# EAGLE schematic schematics (EAGLE 6.1)
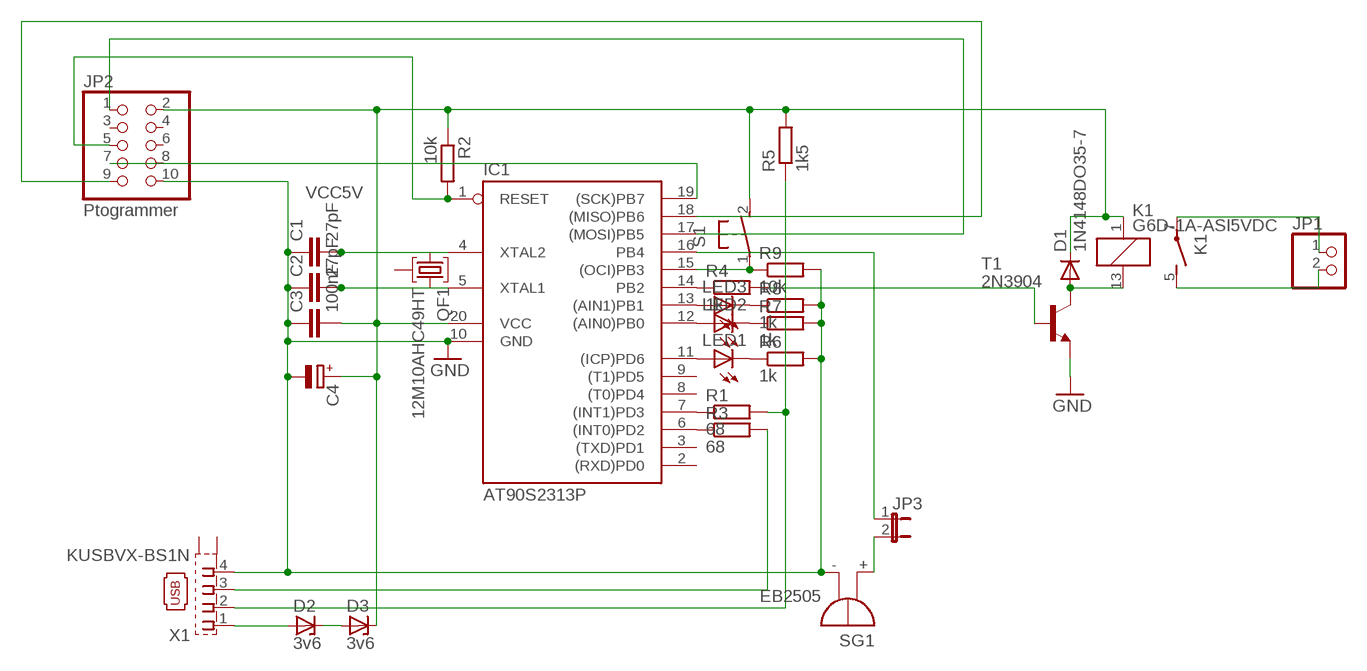
[diagram p0: schematic, sheet 1]

## Parts
C1  27pF  C-EU025-024X044  [C025-024X044]
C2  27pF  C-EU025-024X044  [C025-024X044]
C3  100nF  C-EU025-024X044  [C025-024X044]
C4  CPOL-EUE2.5-7  [E2,5-7]
D1  1N4148DO35-7  [DO35-7]
D2  3v6  ZENER-DIODEDO35Z10  [DO35Z10]
D3  3v6  ZENER-DIODEDO35Z10  [DO35Z10]
IC1  AT90S2313P  [DIL20]
JP1  PINHD-1X2/90  [1X02/90]
JP2  Ptogrammer  PINHD-2X5  [2X05]
JP3  JP1E  [JP1]
K1  G6D-1A-ASI5VDC  [G6D]
LED1  LED3MM  [LED3MM]
LED2  LED3MM  [LED3MM]
LED3  LED3MM  [LED3MM]
QF1  12M10AHC49HT  [HC49U]
R1  68  R-EU_0204/5  [0204/5]
R2  10k  R-EU_0207/10  [0207/10]
R3  68  R-EU_0204/5  [0204/5]
R4  1k  R-EU_0204/5  [0204/5]
R5  1k5  R-EU_0204/5  [0204/5]
R6  1k  R-EU_0204/5  [0204/5]
R7  1k  R-EU_0204/5  [0204/5]
R8  1k  R-EU_0204/5  [0204/5]
R9  10k  R-EU_0207/10  [0207/10]
S1  31-XX  [B3F-31XX]
SG1  EB2505  [EB2505]
T1  2N3904  2N2222-NPN-TO92-EBC  [TO92-EBC]
X1  KUSBVX-BS1N  [KUSBVX-BS1N]

## Nets
GND: C1.1 C2.1 C3.1 C4.- IC1.10(GND) JP2.10 R6.2 R7.2 R8.2 R9.2 SG1.- T1.E X1.4
N$1: IC1.1(RESET) JP2.5 R2.2
N$2: IC1.7((INT1)PD3) R1.1
N$3: C2.2 IC1.5(XTAL1) QF1.3
N$4: IC1.6((INT0)PD2) R3.1
N$5: R1.2 R5.1 X1.2
N$6: IC1.12((AIN0)PB0) LED2.A
N$7: IC1.13((AIN1)PB1) LED3.A
N$8: D1.A K1.13 T1.C
N$9: C1.2 IC1.4(XTAL2) QF1.1
N$10: JP1.1 K1.7(2:P)
N$11: JP1.2 K1.5(2:S)
N$12: D2.C D3.A
N$13: D2.A X1.1
N$14: R3.2 X1.3
N$15: IC1.11((ICP)PD6) LED1.A
N$16: IC1.14(PB2) R4.1
N$17: R4.2 T1.B
N$18: LED2.K(C) R7.1
N$19: LED3.K(C) R8.1
N$20: LED1.K(C) R6.1
N$21: JP3.2 SG1.+
N$22: IC1.15((OCI)PB3) R9.1 S1.1(P)
N$23: IC1.16(PB4) JP3.1
N$24: IC1.17((MOSI)PB5) JP2.1
N$25: IC1.18((MISO)PB6) JP2.9
N$27: IC1.19((SCK)PB7) JP2.7
VCC5V: C3.2 C4.+ D1.C D3.C IC1.20(VCC) JP2.2 K1.1 R2.1 R5.2 S1.2(S)
Unconnected: IC1.2((RXD)PD0) IC1.3((TXD)PD1) IC1.8((T0)PD4) IC1.9((T1)PD5) JP2.3 JP2.4 JP2.6 JP2.8 QF1.2 X1.M1(S1) X1.M2(S2)

## Library data of the parts
C1-C3 = rcl:C-EU: CAPACITOR, European symbol
C4 = rcl:CPOL-EU: POLARIZED CAPACITOR, European symbol
D1 = diode:1N4148: DIODE high speed (Philips)
D2 D3 = diode:ZENER-DIODE: Z-Diode
IC1 = atmel:AT90S2313: MICROCONTROLLER 2 Kbytes FLASH 128 bytes SRAM 128 bytes EEPROM UART; OC_FARNELL: unknown; OC_NEWARK: unknown
JP1 = pinhead:PINHD-1X2: PIN HEADER
JP2 = pinhead:PINHD-2X5: PIN HEADER
JP3 = jumper:JP1E: JUMPER
K1 = relay:G6D?*: OMRON Slim, Miniature PCB Relay 17.5 × 6.5 × 12.5 mm with Socked Source: http://ecb.omron.com.sg/pdf/relay/power/G6D.pdf; OC_FARNELL: 9812660; OC_NEWARK: unknown
LED1-LED3 = led:LED: LED OSRAM: - CHIPLED LG R971, LG N971, LY N971, LG Q971, LY Q971, LO R971, LY R971 LH N974, LH R974 LS Q976, LO Q976, LY Q976 LO Q996 - Hyper CHIPLED LW Q18S LB Q993, LB Q99A, LB R99A - SideLED LS A670, LO A670, LY A670, LG A670, LP A670 LB A673, LV A673, LT A673, LW A673 LH A674 LY A675 LS A676, LA A676, LO A676, LY A676, LW A676 LS A679, LY A679, LG A679 - Hyper Micro SIDELED® LS Y876, LA Y876, LO Y876, LY Y876 LT Y87S - SmartLED LW L88C, LW L88S LB L89C, LB L89S, LG L890 LS L89K, LO L89K, LY L89K LS L896, LA L896, LO L896, LY L896 - TOPLED LS T670, LO T670, LY T670, LG T670, LP T670 LSG T670, LSP T670, LSY T670, LOP T670, LYG T670 LG T671, LOG T671, LSG T671 LB T673, LV T673, LT T673, LW T673 LH T674 LS T676, LA T676, LO T676, LY T676, LB T676, LH T676, LSB T676, LW T676 LB T67C, LV T67C, LT T67C, LS T67K, LO T67K, LY T67K, LW E67C LS E67B, LA E67B, LO E67B, LY E67B, LB E67C, LV E67C, LT E67C LW T67C LS T679, LY T679, LG T679 LS T770, LO T770, LY T770, LG T770, LP T770 LB T773, LV T773, LT T773, LW T773 LH T774 LS E675, LA E675, LY E675, LS T675 LS T776, LA T776, LO T776, LY T776, LB T776 LHGB T686 LT T68C, LB T68C - Hyper Mini TOPLED® LB M676 - Mini TOPLED Santana® LG M470 LS M47K, LO M47K, LY M47K Source: http://www.osram.convergy.de LUXEON: - LUMILED® LXK2-PW12-R00, LXK2-PW12-S00, LXK2-PW14-U00, LXK2-PW14-V00 LXK2-PM12-R00, LXK2-PM12-S00, LXK2-PM14-U00 LXK2-PE12-Q00, LXK2-PE12-R00, LXK2-PE12-S00, LXK2-PE14-T00, LXK2-PE14-U00 LXK2-PB12-K00, LXK2-PB12-L00, LXK2-PB12-M00, LXK2-PB14-N00, LXK2-PB14-P00, LXK2-PB14-Q00 LXK2-PR12-L00, LXK2-PR12-M00, LXK2-PR14-Q00, LXK2-PR14-R00 LXK2-PD12-Q00, LXK2-PD12-R00, LXK2-PD12-S00 LXK2-PH12-R00, LXK2-PH12-S00 LXK2-PL12-P00, LXK2-PL12-Q00, LXK2-PL12-R00 Source: www.luxeon.com KINGBRIGHT: KA-3528ASYC Source: www.kingbright.com
QF1 = crystal:12M10AHC49HT: Monolithic Crystal Filters Source: www.vanlong.com; OC_FARNELL: unknown; OC_NEWARK: unknown
R1-R9 = rcl:R-EU_: RESISTOR, European symbol
S1 = switch-omron:31-XX: OMRON SWITCH; MPN: B3F-3100; OC_FARNELL: 959704; OC_NEWARK: 36M3582
SG1 = buzzer:EB2505: BUZZER Source: Buerklin; OC_FARNELL: unknown; OC_NEWARK: unknown
T1 = transistor-neu-to92:*-NPN-: NPN Transistror
X1 = con-kycon:KUSBVX-BS1N: USB B-type Receptacle Vertical, 4 Position, Through Hole Source: Sibalco Kycon KUSBVX-BS1N-xxx.pdf